# EAGLE design RpiOnOff (EAGLE 6.4)
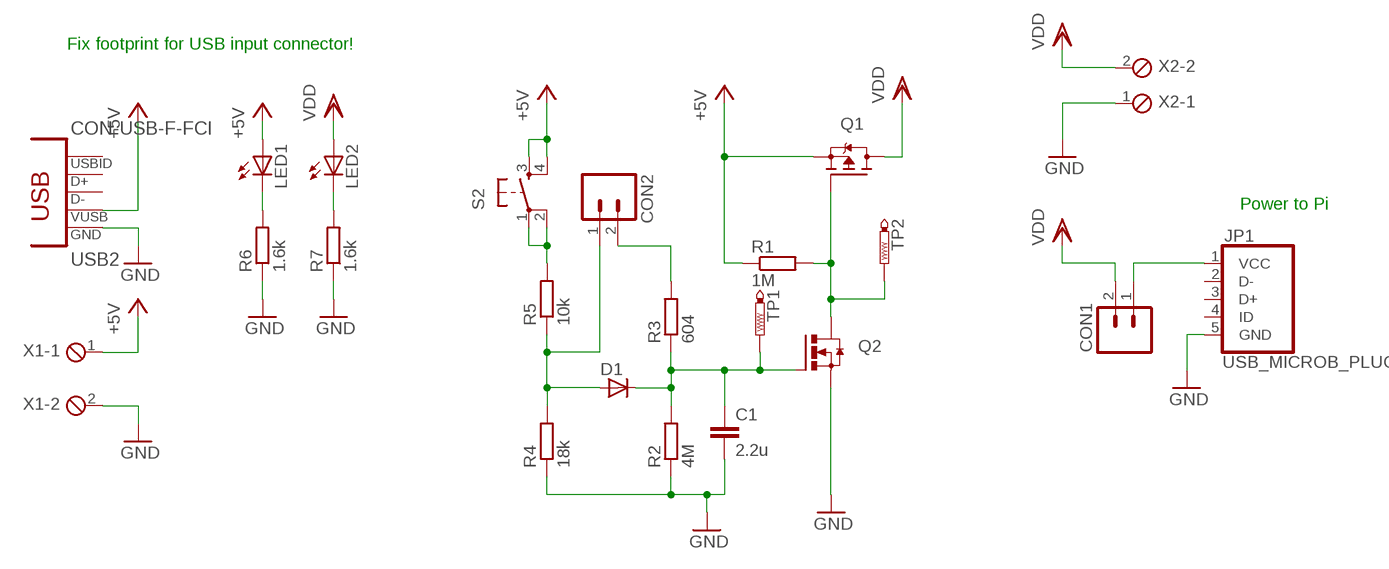
[diagram p0: schematic, sheet 1]

## Parts
C1  2.2u  C-EUC0603  [C0603]
CON1  CONNECTOR-1X2[2.54MM]  [CONNECTOR-1X2-2.54MM]
CON2  CONNECTOR-1X2[2.54MM]  [CONNECTOR-1X2-2.54MM]
D1  D-A1-C3  [SOT23]
JP1  USB_MICROB_PLUG  [CON-USB-MICRO-B-RA-SMT]
LED1  LEDCHIP-LED0603  [CHIP-LED0603]
LED2  LEDCHIP-LED0603  [CHIP-LED0603]
Q1  MOSFET-P-TOSHIBA-SSM3J338R  [SOT23]
Q2  MOSFET-N-SSM3K36MFV  [SOT23]
R1  1M  R-EU_R0603  [R0603]
R2  4M  R-EU_R0603  [R0603]
R3  604  R-EU_R0603  [R0603]
R4  18k  R-EU_R0603  [R0603]
R5  10k  R-EU_R0603  [R0603]
R6  1.6k  R-EU_R0603  [R0603]
R7  1.6k  R-EU_R0603  [R0603]
S2  TACT-4PINCK-PTS810  [CK-PTS810]
TP1  PTR1B1,27  [B1,27]
TP2  PTR1B1,27  [B1,27]
USB2  CON-USB-F-FCI  [AMP-USB-MICROB]
X1  MPT2  [2POL254]
X2  MPT2  [2POL254]

## Nets
+5V [Power]: LED1.A Q1.2(S) R1.1 S2.3(S) S2.4(S1) USB2.1(VUSB) X1.1
GND [Power]: C1.2 JP1.5(GND) Q2.2(S) R2.1 R4.1 R6.1 R7.1 USB2.5(GND) X1.2 X2.1
N$1: LED1.C R6.2
N$2: LED2.C R7.2
N$3: CON1.1 JP1.1(VCC)
N$4: R5.2 S2.1(P) S2.2(P1)
Q1GATE: Q1.1(G) Q2.3(D) R1.2 TP2.TP
Q2GATE: C1.1 D1.3(C) Q2.1(G) R2.2 R3.1 TP1.TP
SENSE: CON2.1 D1.1(A) R4.2 R5.1
TX: CON2.2 R3.2
VDD: CON1.2 LED2.A Q1.3(D) X2.2
Unconnected: JP1.2(D-) JP1.3(D+) JP1.4(ID) USB2.2(D-) USB2.3(D+) USB2.4(USBID) USB2.SHIELD1(BODY) USB2.SHIELD2(BODY) USB2.SHIELD3(BODY) USB2.SHIELD4(BODY)

## Notes on the sheet
- Fix footprint for USB input connector!
- Power to Pi

## Library data of the parts
C1 = Erland's Library:C-EU: CAPACITOR, European symbol
CON1 CON2 = 11-egna-ic:CONNECTOR-1X2
D1 = Erland's Library:D-: DIODE unfilled
JP1 = Erland's Library:USB_MICROB_PLUG: USB Micro-B Plug Comes in a variety of packages. Check out Hirose's ZX-x0 line: http://www.hirose.co.jp/cataloge_hp/e24200011.pdf
LED1 LED2 = led:LED: LED OSRAM: - CHIPLED LG R971, LG N971, LY N971, LG Q971, LY Q971, LO R971, LY R971 LH N974, LH R974 LS Q976, LO Q976, LY Q976 LO Q996 - Hyper CHIPLED LW Q18S LB Q993, LB Q99A, LB R99A - SideLED LS A670, LO A670, LY A670, LG A670, LP A670 LB A673, LV A673, LT A673, LW A673 LH A674 LY A675 LS A676, LA A676, LO A676, LY A676, LW A676 LS A679, LY A679, LG A679 - Hyper Micro SIDELED® LS Y876, LA Y876, LO Y876, LY Y876 LT Y87S - SmartLED LW L88C, LW L88S LB L89C, LB L89S, LG L890 LS L89K, LO L89K, LY L89K LS L896, LA L896, LO L896, LY L896 - TOPLED LS T670, LO T670, LY T670, LG T670, LP T670 LSG T670, LSP T670, LSY T670, LOP T670, LYG T670 LG T671, LOG T671, LSG T671 LB T673, LV T673, LT T673, LW T673 LH T674 LS T676, LA T676, LO T676, LY T676, LB T676, LH T676, LSB T676, LW T676 LB T67C, LV T67C, LT T67C, LS T67K, LO T67K, LY T67K, LW E67C LS E67B, LA E67B, LO E67B, LY E67B, LB E67C, LV E67C, LT E67C LW T67C LS T679, LY T679, LG T679 LS T770, LO T770, LY T770, LG T770, LP T770 LB T773, LV T773, LT T773, LW T773 LH T774 LS E675, LA E675, LY E675, LS T675 LS T776, LA T776, LO T776, LY T776, LB T776 LHGB T686 LT T68C, LB T68C - Hyper Mini TOPLED® LB M676 - Mini TOPLED Santana® LG M470 LS M47K, LO M47K, LY M47K Source: http://www.osram.convergy.de LUXEON: - LUMILED® LXK2-PW12-R00, LXK2-PW12-S00, LXK2-PW14-U00, LXK2-PW14-V00 LXK2-PM12-R00, LXK2-PM12-S00, LXK2-PM14-U00 LXK2-PE12-Q00, LXK2-PE12-R00, LXK2-PE12-S00, LXK2-PE14-T00, LXK2-PE14-U00 LXK2-PB12-K00, LXK2-PB12-L00, LXK2-PB12-M00, LXK2-PB14-N00, LXK2-PB14-P00, LXK2-PB14-Q00 LXK2-PR12-L00, LXK2-PR12-M00, LXK2-PR14-Q00, LXK2-PR14-R00 LXK2-PD12-Q00, LXK2-PD12-R00, LXK2-PD12-S00 LXK2-PH12-R00, LXK2-PH12-S00 LXK2-PL12-P00, LXK2-PL12-Q00, LXK2-PL12-R00 Source: www.luxeon.com KINGBRIGHT: KA-3528ASYC Source: www.kingbright.com
Q1 = Erland's Library:MOSFET-P
Q2 = Erland's Library:MOSFET-N
R1-R7 = Erland's Library:R-EU_: RESISTOR, European symbol
S2 = Erland's Library:TACT-4PIN: OMRON SWITCH
TP1 TP2 = testpad:PTR1: TEST PIN
USB2 = Erland's Library:CON-USB-F: USB Female connector
X1 X2 = con-phoenix-254:MPT2: PHOENIX CONNECTOR; OC_FARNELL: unknown; OC_NEWARK: unknown

## Net classes
1 Power: width 3 mm, clearance 0.152 mm

## Board
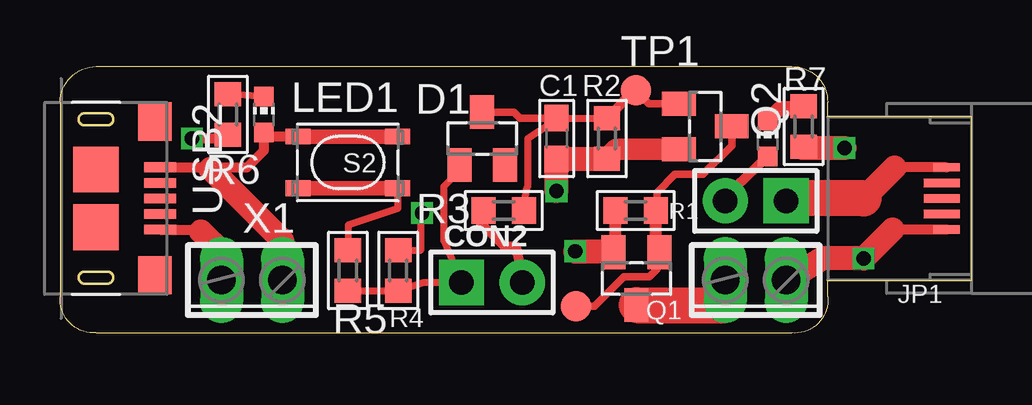
[diagram p1: board, top side]
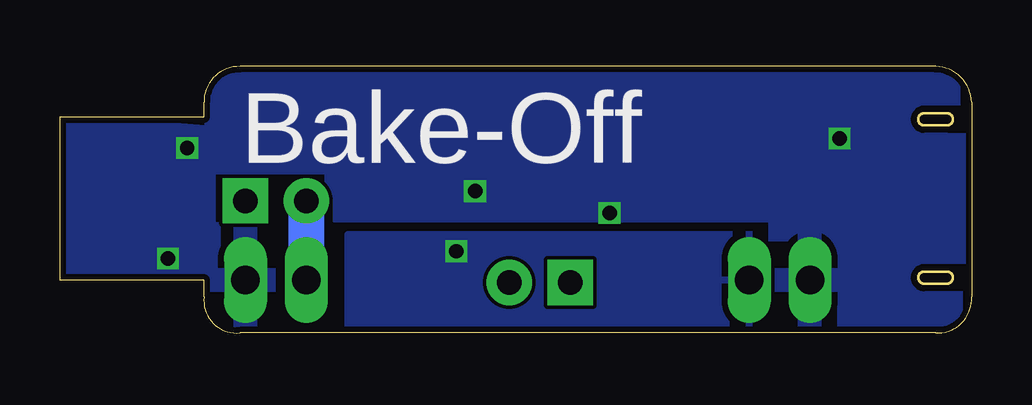
[diagram p2: board, bottom side, seen from below]

Size 38 x 11.11 mm. Coordinates in mm from the lower left corner, seen from the top.
Outline: 1.5,0.01 30.5,0.01 arc101 32,1.51 32,2.21 38,2.21 38,9.01 32,9.01 32,9.61 arc93 30.5,11.11 1.5,11.11 arc89 0,9.61 0,1.51 arc97 1.5,0.01
Copper layers (1*16): Top 0.035mm / dielectric 1.5mm / Bottom 0.035mm
Design rules "Fusion_eagle_rule_v1.1": minimum track width 6mil, minimum drill 12mil, track to track 6mil, track to pad 6mil, pad to pad 6mil, via to via 6mil, smd to smd 0mil, copper to edge 10mil, drill to drill 10mil, minimum pad ring 10mil, minimum via ring 6mil, stop-mask expansion 2mil, vias tented up to drill 100mil, thermal gap 10mil

### Footprints (pad centres in the part's own frame; a part is rotated, then mirrored left to right if it is on the bottom)
C0603 = smd 1.1 x 1: 1 -0.85,0; 2 0.85,0
CONNECTOR-1X2-2.54MM = drill 1.016 pad 1.88 square: 1 -1.27,0 | drill 1.016 pad 1.88: 2 1.27,0
SOT23 = smd 1 x 1.4: 1 -0.95,-1.1; 2 0.95,-1.1; 3 0,1.1
CON-USB-MICRO-B-RA-SMT = smd 0.35 x 1.1: 1 1.3,-1.95; 5 -1.3,-1.95 | smd 0.35 x 1.5: 2 0.65,-1.75; 3 0,-1.75; 4 -0.65,-1.75
CHIP-LED0603 = smd 0.8 x 0.8: A 0,-0.75; C 0,0.75
R0603 = smd 1 x 1.1: 1 -0.85,0; 2 0.85,0
CK-PTS810 = smd 1.05 x 0.65: 1 -2.075,1.075; 2 2.075,1.075; 3 -2.075,-1.075; 4 2.075,-1.075
B1,27 = smd 1.27 x 1.27: TP 0,0
AMP-USB-MICROB = smd 0.4 x 1.35: 1 -1.3,2.675; 2 -0.65,2.675; 3 0,2.675; 4 0.65,2.675; 5 1.3,2.675 | smd 1.6 x 1.4: SHIELD1 -3.2,2.45; SHIELD2 3.2,2.45 | smd 1.9 x 1.9: SHIELD3 -1.2,0; SHIELD4 1.2,0
2POL254 = drill 1.2 long: 1 -1.27,0; 2 1.27,0

### Placement (x,y rotation side)
C1  20.7,8.11 270 top
CON1  29,5.51 180 top
CON2  18,2.11 0 top
D1  17.6,8.11 0 top
JP1  35,5.61 90 top
LED1  8.5,9.11 0 top
LED2  29.5,8.11 0 top
Q1  24.03,2.27 180 top
Q2  26.9,8.61 270 top
R1  24,5.11 0 top
R2  22.8,8.11 90 top
R3  18.5,5.11 180 top
R4  14.1,2.61 270 top
R5  12,2.61 90 top
R6  7,9.11 90 top
R7  31,8.61 90 top
S2  12,7.11 180 top
TP1  24,10.11 0 top
TP2  21.5,1.11 0 top
USB2  1.5,5.61 270 top
X1  8,2.21 180 top
X2  29,2.21 180 top

### Tracks (layer width: path | path; a pad name or v marks a point on that pad's centre or on a via)
+5V  (via drill 0.6)
  Top 0.406: USB2.1 6.27,6.91 | 6.27,6.91 6.27,6.84 | 6.27,6.91 7.8,6.91 8.5,7.61 LED1.A 8.68,8.18 S2.4
  Top 0.5: R1.1 23.15,3.37 Q1.2 23.08,3.41
  Top 0.6: S2.4 S2.3
  Top 1: 6.27,6.84 9.27,3.84 X1.1 | v21.48,3.41 23.08,3.41
  pour Bottom: 9,0.11 26,0.11 26,4.11 9,4.11
GND  (via drill 0.6)
  Top 0.3: R4.1 15.04,3.46 15.04,5.33 v15.09,5.01
  Top 0.406: USB2.5 5.87,4.31 5.87,4.24 | v5.5,8.11 7,8.11 R6.1 | JP1.5 34.7,4.31
  Top 0.9: R2.1 23.2,7.66 Q2.2
  Top 1: 5.87,4.24 6.73,3.38 X1.2 | R2.1 C1.2 v20.7,5.91 | X2.1 31.77,3.11 v33.5,3.11 34.7,4.31 | v32.7,7.71 30.95,7.71 R7.1
  pour Bottom: 0,11.11 31.5,10.61 31.5,8.11 37.5,8.61 37.5,2.61 32,2.11 32,0.11 29.5,0.11 29.5,4.11 32,4.11 32,7.11 26.5,7.11 26.5,5.11 8,5.11 8,0.11 0,0.11
N$1
  Top 0.3: R6.2 7.4,9.96 LED1.C
N$2
  Top 0.4: 30.9,9.36 R7.2
  Top 0.6: 30.9,9.36 30,9.36 LED2.C
N$3
  Top 0.406: JP1.1 34.8,6.91 | 30.37,5.61 CON1.1
  Top 1: 34.8,6.91 33.5,5.61
  Top 1.5: 33.5,5.61 30.37,5.61
N$4
  Top 0.3: S2.1 14.08,5.18 12.01,4.5 R5.2
  Top 0.6: S2.2 S2.1
Q1GATE
  Top 0.203: 24.88,3.37 24.88,2.65
  Top 0.305: 24.88,2.65 24.58,2.34 23.51,2.34 22.27,1.11 TP2.TP | R1.2 24.88,5.14 24.88,5.85 25.64,6.61 26.8,6.61 28,7.81 Q2.3
  Top 0.5: Q1.1 24.88,3.37 24.85,3.37 R1.2
Q2GATE
  Top 0.3: R3.1 19.45,6.01 19.5,6.11 19.5,8.11 20.95,9.06 C1.1 R2.2
  Top 0.305: TP1.TP 24.55,9.56 Q2.1 | D1.3 18.94,9.2 19.18,8.96 C1.1
  Top 0.406: R2.2 23.95,10.11 TP1.TP
SENSE
  Top 0.3: R5.1 R4.2 15.15,2.11 CON2.1 16,3.84 16,6.11 16.9,7.01 D1.1
TX
  Top 0.4: R3.2 17.5,5.06 17.5,4.61 18.5,3.61 19,3.61 19.27,2.34 CON2.2
VDD
  Top 0.4: CON1.2 27.73,5.67 LED2.A
  Top 1.5: Q1.3 27.73,1.17 X2.2
  Bottom 1.5: CON1.2 X2.2

### Text on the board
bPlace: Bake-Off